# EAGLE design MixerModular_main (EAGLE 9.6.2)
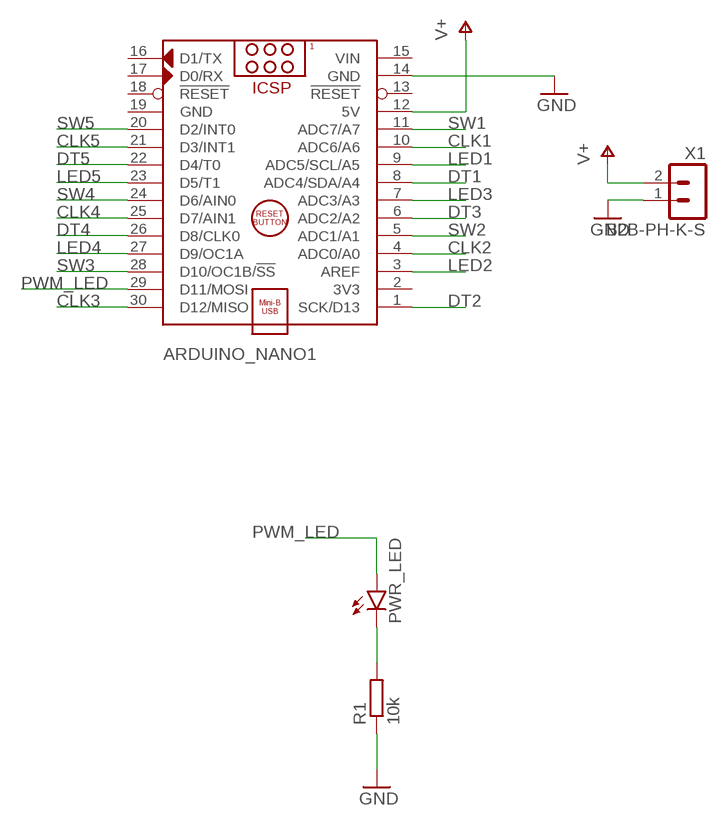
[diagram p0: schematic, sheet 1]

## Parts
ARDUINO_NANO1  ARDUINO_NANO  [ARDUINO_NANO]
PWR_LED  LED5MM  [LED5MM]
R1  10k  R-EU_0207/10  [0207/10]
X1  B2B-PH-K-S  [B2B-PH-K-S]

## Nets
CLK1: ARDUINO_NANO1.10(ADC6/A6)
CLK2: ARDUINO_NANO1.4(ADC0/A0)
CLK3: ARDUINO_NANO1.30(D12/MISO)
CLK4: ARDUINO_NANO1.25(D7/AIN1)
CLK5: ARDUINO_NANO1.21(D3/INT1)
DT1: ARDUINO_NANO1.8(ADC4/SDA/A4)
DT2: ARDUINO_NANO1.1(SCK/D13)
DT3: ARDUINO_NANO1.6(ADC2/A2)
DT4: ARDUINO_NANO1.26(D8/CLK0)
DT5: ARDUINO_NANO1.22(D4/T0)
GND: ARDUINO_NANO1.14(GND) R1.1 X1.1
LED1: ARDUINO_NANO1.9(ADC5/SCL/A5)
LED2: ARDUINO_NANO1.3(AREF)
LED3: ARDUINO_NANO1.7(ADC3/A3)
LED4: ARDUINO_NANO1.27(D9/OC1A)
LED5: ARDUINO_NANO1.23(D5/T1)
N$1: PWR_LED.K(C) R1.2
PWM_LED: ARDUINO_NANO1.29(D11/MOSI) PWR_LED.A
SW1: ARDUINO_NANO1.11(ADC7/A7)
SW2: ARDUINO_NANO1.5(ADC1/A1)
SW3: ARDUINO_NANO1.28(D10/OC1B/!SS)
SW4: ARDUINO_NANO1.24(D6/AIN0)
SW5: ARDUINO_NANO1.20(D2/INT0)
V+: ARDUINO_NANO1.12(5V) X1.2
Unconnected: ARDUINO_NANO1.2(3V3) ARDUINO_NANO1.13(!RESET) ARDUINO_NANO1.16(D1/TX) ARDUINO_NANO1.17(D0/RX) ARDUINO_NANO1.18(!RESET)

## Power pins joined to a net without a drawn wire
GND: ARDUINO_NANO1.19(GND)
VIN: ARDUINO_NANO1.15(VIN)

## Library data of the parts
ARDUINO_NANO1 = ArduinoNanoV30:ARDUINO_NANO: Arduino Nano V3.0 Module Overview: The Arduino Nano is a small, complete, and breadboard-friendly board based on the ATmega328 (Arduino Nano 3.x) or ATmega168 (Arduino Nano 2.x). It has more or less the same functionality of the Arduino Duemilanove, but in a different package. It lacks only a DC power jack, and works with a Mini-B USB cable instead of a standard one. The Nano was designed and is being produced by Gravitech <http://www.gravitech.us/arna30wiatp.html>. General specifications: Item Value Microcontroller Atmel ATmega168 or ATmega328 Operating Voltage (logic level) 5 V Input Voltage (recommended) 7-12 V Input Voltage (limits) 6-20 V Digital I/O Pins 14 (of which 6 provide PWM output) Analog Input Pins 8 DC Current per I/O Pin 40 mA Flash Memory 16 KB (ATmega168) or 32 KB (ATmega328) of which 2 KB used by bootloader SRAM 1 KB (ATmega168) or 2 KB (ATmega328) EEPROM 512 bytes (ATmega168) or 1 KB (ATmega328) Clock Speed 16 MHz Dimensions (Inches) 0.73" x 1.70" Dimensions (mm) 18mm x 45mm Overall height About 9 mm (not including pins) Weigth 5 g Power: The Arduino Nano can be powered via the Mini-B USB connection, 6-20V unregulated external power supply (pin 30), or 5V regulated external power supply (pin 27). The power source is automatically selected to the highest voltage source. Memory: The ATmega168 has 16 KB of flash memory for storing code (of which 2 KB is used for the bootloader); the ATmega328 has 32 KB, (also with 2 KB used for the bootloader). The ATmega168 has 1 KB of SRAM and 512 bytes of EEPROM (which can be read and written with the EEPROM library); the ATmega328 has 2 KB of SRAM and 1 KB of EEPROM. Input and Output: Each of the 14 digital pins on the Nano can be used as an input or output, using pinMode(), digitalWrite(), and digitalRead() functions. They operate at 5 volts. Each pin can provide or receive a maximum of 40 mA and has an internal pull-up resistor (disconnected by default) of 20-50 kOhms. In addition, some pins have specialized functions. Visit Arduino - ArduinoBoardNano <https://www.arduino.cc/en/Main/ArduinoBoardNano>
PWR_LED = led:LED: LED OSRAM: - CHIPLED LG R971, LG N971, LY N971, LG Q971, LY Q971, LO R971, LY R971 LH N974, LH R974 LS Q976, LO Q976, LY Q976 LO Q996 - Hyper CHIPLED LW Q18S LB Q993, LB Q99A, LB R99A - SideLED LS A670, LO A670, LY A670, LG A670, LP A670 LB A673, LV A673, LT A673, LW A673 LH A674 LY A675 LS A676, LA A676, LO A676, LY A676, LW A676 LS A679, LY A679, LG A679 - Hyper Micro SIDELED® LS Y876, LA Y876, LO Y876, LY Y876 LT Y87S - SmartLED LW L88C, LW L88S LB L89C, LB L89S, LG L890 LS L89K, LO L89K, LY L89K LS L896, LA L896, LO L896, LY L896 - TOPLED LS T670, LO T670, LY T670, LG T670, LP T670 LSG T670, LSP T670, LSY T670, LOP T670, LYG T670 LG T671, LOG T671, LSG T671 LB T673, LV T673, LT T673, LW T673 LH T674 LS T676, LA T676, LO T676, LY T676, LB T676, LH T676, LSB T676, LW T676 LB T67C, LV T67C, LT T67C, LS T67K, LO T67K, LY T67K, LW E67C LS E67B, LA E67B, LO E67B, LY E67B, LB E67C, LV E67C, LT E67C LW T67C LS T679, LY T679, LG T679 LS T770, LO T770, LY T770, LG T770, LP T770 LB T773, LV T773, LT T773, LW T773 LH T774 LS E675, LA E675, LY E675, LS T675 LS T776, LA T776, LO T776, LY T776, LB T776 LHGB T686 LT T68C, LB T68C - Hyper Mini TOPLED® LB M676 - Mini TOPLED Santana® LG M470 LS M47K, LO M47K, LY M47K Source: http://www.osram.convergy.de LUXEON: - LUMILED® LXK2-PW12-R00, LXK2-PW12-S00, LXK2-PW14-U00, LXK2-PW14-V00 LXK2-PM12-R00, LXK2-PM12-S00, LXK2-PM14-U00 LXK2-PE12-Q00, LXK2-PE12-R00, LXK2-PE12-S00, LXK2-PE14-T00, LXK2-PE14-U00 LXK2-PB12-K00, LXK2-PB12-L00, LXK2-PB12-M00, LXK2-PB14-N00, LXK2-PB14-P00, LXK2-PB14-Q00 LXK2-PR12-L00, LXK2-PR12-M00, LXK2-PR14-Q00, LXK2-PR14-R00 LXK2-PD12-Q00, LXK2-PD12-R00, LXK2-PD12-S00 LXK2-PH12-R00, LXK2-PH12-S00 LXK2-PL12-P00, LXK2-PL12-Q00, LXK2-PL12-R00 Source: www.luxeon.com KINGBRIGHT: KA-3528ASYC Source: www.kingbright.com
R1 = rcl:R-EU_: RESISTOR, European symbol; SPICEPREFIX: R
X1 = con-JST PH:B2B-PH: JST PH series header 2.00mm pitch disconnectable crimp style connectors, vertical (side entry type), 2 pins

## Board
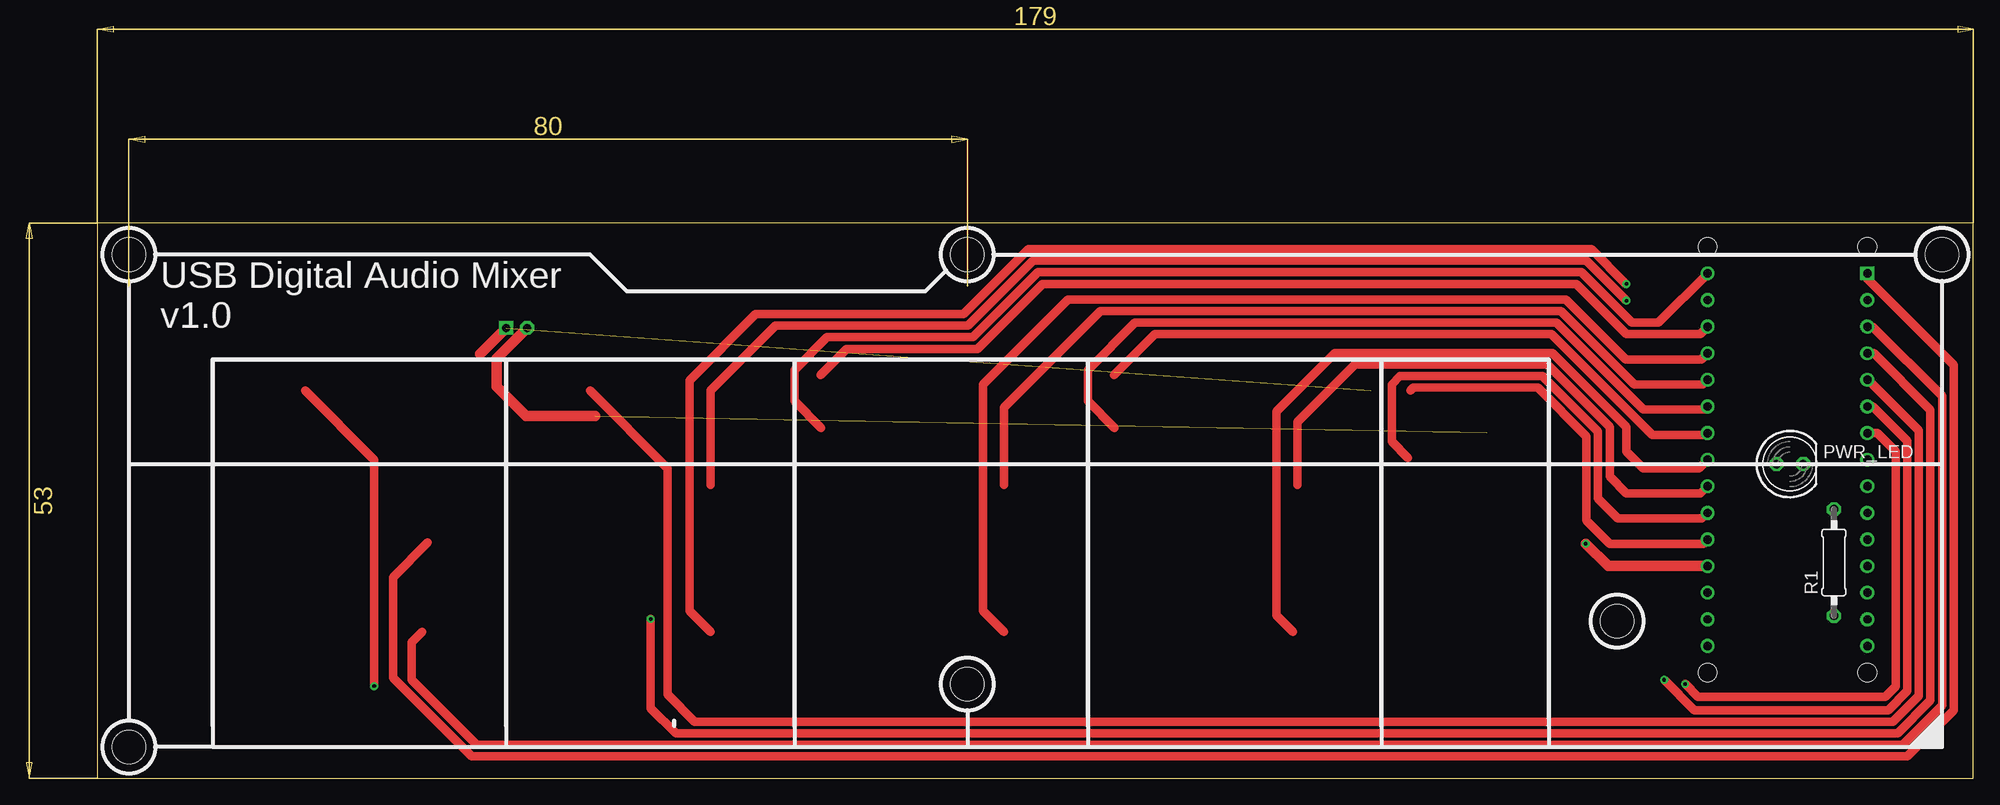
[diagram p1: board, top side]
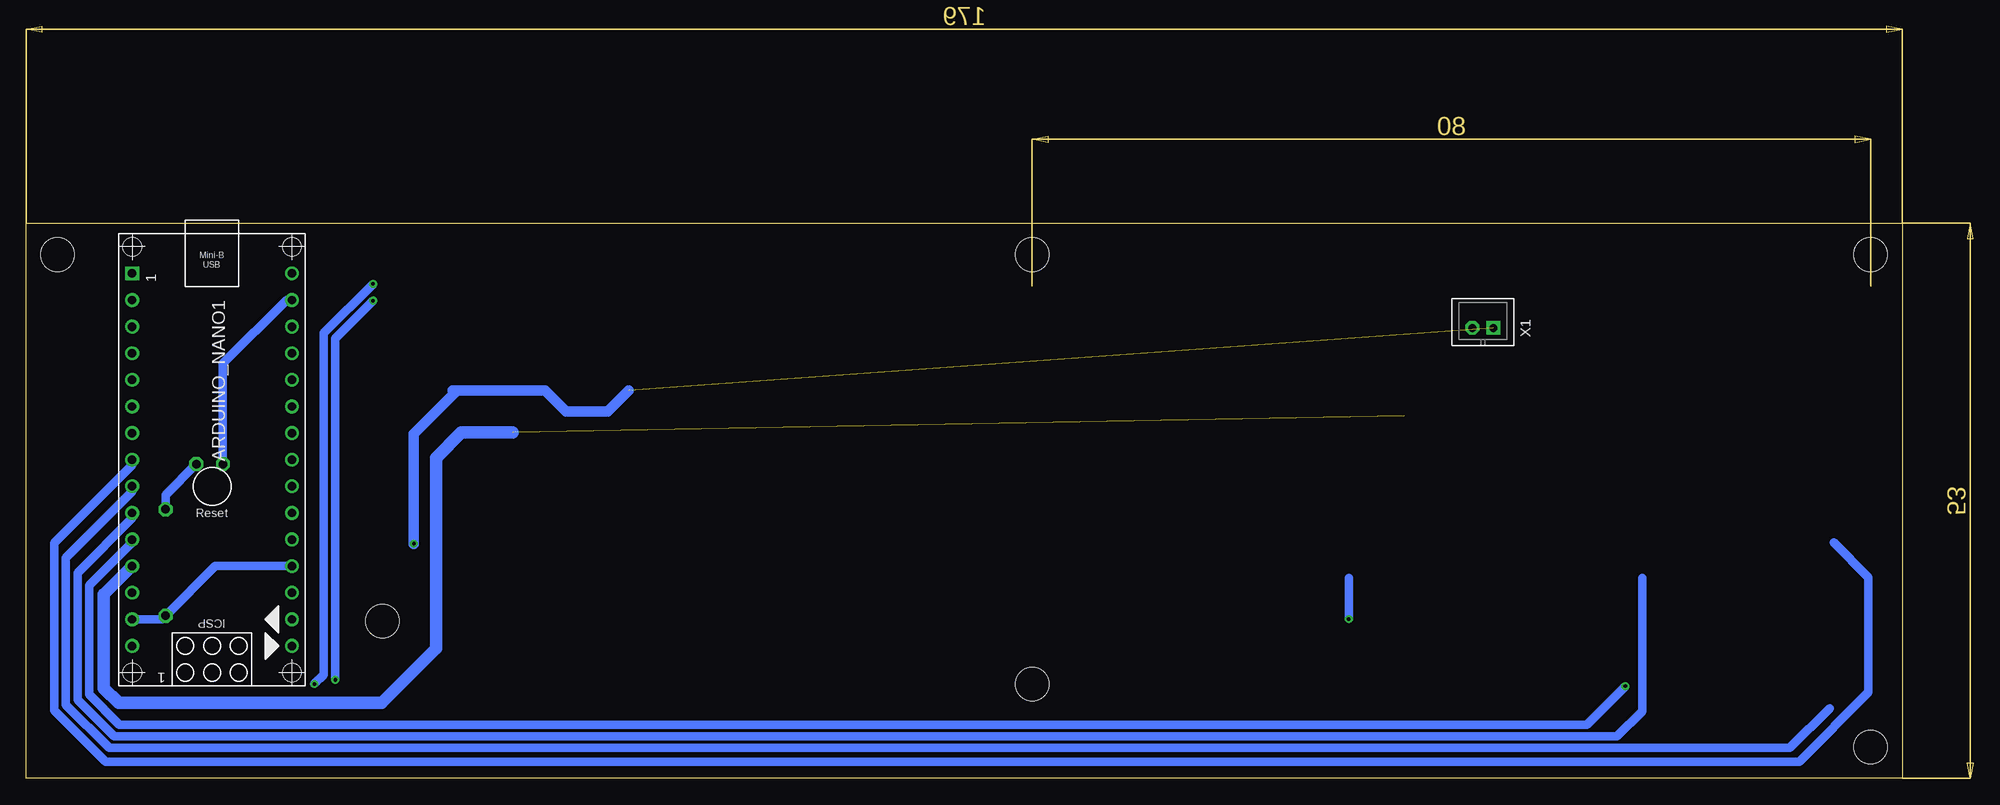
[diagram p2: board, bottom side, seen from below]

Size 179 x 53 mm. Coordinates in mm from the lower left corner, seen from the top.
Outline: 0,0 179,0 179,53 0,53 0,0
Copper layers (1*16): Top 0.035mm / dielectric 1.5mm / Bottom 0.035mm
Design rules "default *": minimum track width 6mil, minimum drill 0.35mm, track to track 12mil, track to pad 6mil, pad to pad 6mil, via to via 6mil, smd to smd 6mil, copper to edge 40mil, drill to drill 6mil, minimum pad ring 10mil, minimum via ring 8mil, stop-mask expansion 4mil, vias tented up to drill 0mil, thermal gap 10mil
Holes 3.2 mm at 3,3 3,50 176,50 83,50 145,15 83,9

### Footprints (pad centres in the part's own frame; a part is rotated, then mirrored left to right if it is on the bottom)
ARDUINO_NANO = drill 0.8 square: 1 -20.32,-7.62 | drill 0.8: 2 -17.78,-7.62; 3 -15.24,-7.62; 4 -12.7,-7.62; 5 -10.16,-7.62; 6 -7.62,-7.62; 7 -5.08,-7.62; 8 -2.54,-7.62; 9 0,-7.62; 10 2.54,-7.62; 11 5.08,-7.62; 12 7.62,-7.62; 13 10.16,-7.62; 14 12.7,-7.62; 15 15.24,-7.62; 16 15.24,7.62; 17 12.7,7.62; 18 10.16,7.62; 19 7.62,7.62; 20 5.08,7.62; 21 2.54,7.62; 22 0,7.62; 23 -2.54,7.62; 24 -5.08,7.62; 25 -7.62,7.62; 26 -10.16,7.62; 27 -12.7,7.62; 28 -15.24,7.62; 29 -17.78,7.62; 30 -20.32,7.62 | hole 1.778: -22.86,-7.62; -22.86,7.62; 17.78,7.62; 17.78,-7.62
LED5MM = drill 0.813 octagon: A -1.27,0; K 1.27,0
0207/10 = drill 0.813 octagon: 1 -5.08,0; 2 5.08,0
B2B-PH-K-S = drill 0.75 pad 1.3 square: 1 1,0 | drill 0.75 pad 1.3 octagon: 2 -1,0

### Placement (x,y rotation side)
ARDUINO_NANO1  161.27,27.88 270 bottom
PWR_LED  161.5,30 0 top
R1  165.7,20.6 90 top
X1  40,43 0 bottom

### Tracks (layer width: path | path; a pad name or v marks a point on that pad's centre or on a via)
CLK1
  Bottom 0.8: 24.8,19.12 24.8,6.4 27.2,4 170.6,4 174.1,7.5 174.1,19.62 168.89,24.84 ARDUINO_NANO1.10
CLK2  (via drill 0.35)
  Top 0.8: v52.8,15.2 52.8,6.71 55.2,4.3 171.79,4.3 174.91,7.43 174.91,35.19 169.52,40.58 ARDUINO_NANO1.4
  Bottom 0.8: 52.8,19.12 v52.8,15.2
CLK3
  Top 0.8: 69.05,33.45 66.5,36 66.5,39 69.61,42.1 83.54,42.1 89.74,48.3 141.59,48.3 146.4,43.51 148.96,43.51 ARDUINO_NANO1.30
CLK4
  Top 0.8: 97.05,33.45 94.5,36 94.5,39 99,43.51 139.21,43.51 147.51,35.2 153.35,35.2 ARDUINO_NANO1.25
CLK5
  Top 0.8: 125.05,30.6 123.5,32.15 123.5,37.6 124.3,38.4 137.9,38.4 143.19,33.1 143.19,26.7 145.1,24.8 153.11,24.8 ARDUINO_NANO1.21
DT1
  Bottom 0.8: 6.5,22.5 3.2,19.2 3.2,8.2 9.8,1.6 171.4,1.6 176.31,6.51 176.31,22.5 168.89,29.92 ARDUINO_NANO1.8
DT2
  Top 0.8: 31.5,22.5 28.2,19.2 28.2,9.6 35.7,2.1 172.71,2.1 177.12,6.51 177.12,39.47 168.89,47.7 ARDUINO_NANO1.1
DT3  (via drill 0.35)
  Top 0.8: 58.5,28 58.5,37 64.71,43.21 83.08,43.21 89.28,49.41 142.09,49.41 v145.9,45.6 | v149.5,9.4 152.39,6.51 170.88,6.51 172.71,8.34 172.71,32.2 169.4,35.5 ARDUINO_NANO1.6
  Bottom 0.8: v145.9,45.6 149.5,42 v149.5,9.4
DT4
  Top 0.8: 86.5,28 86.5,35.4 95.71,44.61 139.66,44.61 146.68,37.6 153.21,37.6 ARDUINO_NANO1.26
DT5
  Top 0.8: 114.5,28 114.5,34 120,39.51 138.36,39.51 144.3,33.56 144.3,28.8 145.9,27.2 152.97,27.2 ARDUINO_NANO1.22
GND  (via drill 0.35)  (1 unrouted)
  Top 1: ARDUINO_NANO1.19 144.15,20.26 v142.01,22.4 | X1.1 36.5,40.5
  Bottom 0.8: ARDUINO_NANO1.19 160.96,20.26 R1.1 166.04,15.18 ARDUINO_NANO1.14
  Bottom 1: 137.9,37 142.01,32.89 v142.01,22.4
  Bottom 1.016: 121.5,37 123.5,35 127.5,35 129.5,37 137.9,37 138.3,37
LED1
  Bottom 0.8: ARDUINO_NANO1.9 168.89,27.38 175.21,21.06 175.21,7.01 171.09,2.9 10.71,2.9 6.91,6.7
LED2
  Top 0.8: ARDUINO_NANO1.3 169.38,43.12 176.02,36.48 176.02,6.97 172.25,3.2 36.2,3.2 30,9.4 30,13 31,14
LED3  (via drill 0.35)
  Top 0.8: v145.9,47.2 145.86,47.2 142.55,50.51 88.83,50.51 82.63,44.31 62.81,44.31 56.5,38 56.5,16 58.5,14 | v151.5,9 152.71,7.79 170.59,7.79 171.6,8.8 171.6,31.2 169.84,32.96 ARDUINO_NANO1.7
  Bottom 0.8: v145.9,47.2 150.6,42.49 150.6,9.89 v151.5,9
LED4
  Top 0.8: ARDUINO_NANO1.27 153.07,40 145.84,40 140.12,45.71 92.61,45.71 84.5,37.6 84.5,16 86.5,14
LED5
  Top 0.8: ARDUINO_NANO1.23 152.83,29.6 147.5,29.6 145.9,31.2 145.9,33.52 138.81,40.61 119.55,40.61 119.54,40.6 118.1,40.6 112.5,35 112.5,15.55 114.06,14
N$1
  Bottom 0.8: PWR_LED.K 165.7,27.07 R1.2
PWM_LED
  Bottom 0.8: ARDUINO_NANO1.29 154.15,45.66 160.23,39.58 PWR_LED.A
SW1  (via drill 0.35)
  Top 0.8: 19.8,37 26.4,30.4 v26.4,8.8
  Bottom 0.8: v26.4,8.8 30.09,5.11 170.1,5.11 173,8 173,18.4 168.89,22.51 ARDUINO_NANO1.11
SW2
  Top 0.8: 47,37 54.4,29.6 54.4,8 56.99,5.41 171.33,5.41 173.81,7.88 173.81,33.19 168.96,38.04 ARDUINO_NANO1.5
SW3
  Top 0.8: 69,38.5 71.5,41 84,41 90.2,47.2 141.1,47.2 145.9,42.4 152.93,42.4 ARDUINO_NANO1.28
SW4
  Top 0.8: 97,38.5 100.9,42.4 138.75,42.4 148.35,32.8 153.49,32.8 ARDUINO_NANO1.24
SW5
  Top 0.8: 125.3,37 125.59,37.3 137.44,37.3 142.09,32.65 142.09,24.61 144.3,22.4 153.25,22.4 ARDUINO_NANO1.20
V+  (1 unrouted)
  Top 1: X1.2 38.09,40.09 38.09,37.42 40.92,34.59 47.49,34.59
  Bottom 1.2: 132.58,33 137.5,33 139.9,30.6 139.9,12.4 145.1,7.2 170.19,7.2 171.59,8.6 171.59,17.55 ARDUINO_NANO1.12

### Text on the board
tPlace: USB Digital Audio Mixer / v1.0